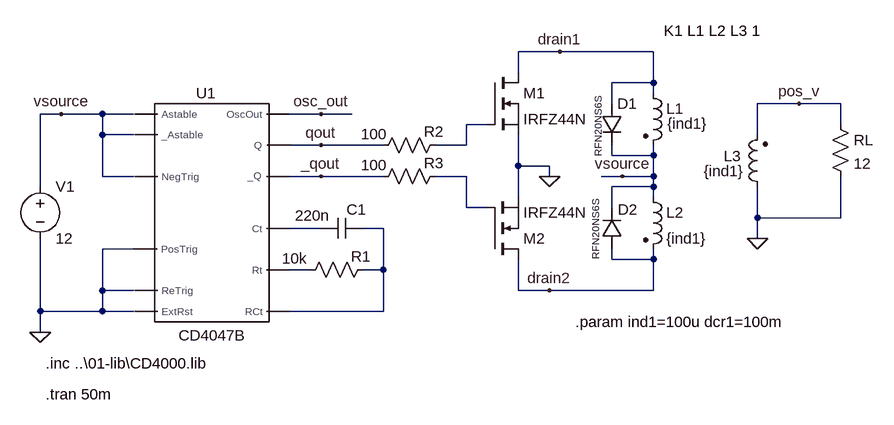
[diagram p0: schematic 02-cd4047b_inverter.asc]
02-cd4047b_inverter.asc, the LTspice schematic file:
Version 4
SHEET 1 1236 680
WIRE 752 -48 688 -48
WIRE 896 -48 752 -48
WIRE 688 -16 688 -48
WIRE 896 0 896 -48
WIRE 896 0 832 0
WIRE 896 16 896 0
WIRE 832 32 832 0
WIRE 1120 32 1056 32
WIRE 1184 32 1120 32
WIRE -16 48 -48 48
WIRE 48 48 -16 48
WIRE 96 48 48 48
WIRE 384 48 336 48
WIRE 432 48 384 48
WIRE 640 64 608 64
WIRE 1184 64 1184 32
WIRE 48 80 48 48
WIRE 96 80 48 80
WIRE 1056 80 1056 32
WIRE 384 96 336 96
WIRE 480 96 384 96
WIRE 608 96 608 64
WIRE 608 96 560 96
WIRE 832 112 832 96
WIRE 896 112 896 96
WIRE 896 112 832 112
WIRE 688 128 688 80
WIRE 736 128 688 128
WIRE 48 144 48 80
WIRE 96 144 48 144
WIRE 384 144 336 144
WIRE 480 144 384 144
WIRE 608 144 560 144
WIRE 736 144 736 128
WIRE 848 144 816 144
WIRE 896 144 896 112
WIRE 896 144 848 144
WIRE -48 160 -48 48
WIRE 896 160 896 144
WIRE 896 160 832 160
WIRE 688 176 688 128
WIRE 896 176 896 160
WIRE 608 192 608 144
WIRE 640 192 608 192
WIRE 832 192 832 160
WIRE 1056 208 1056 160
WIRE 1184 208 1184 144
WIRE 1184 208 1056 208
WIRE 384 224 336 224
WIRE 480 224 448 224
WIRE 1056 240 1056 208
WIRE 96 256 48 256
WIRE 832 272 832 256
WIRE 896 272 896 256
WIRE 896 272 832 272
WIRE 368 288 336 288
WIRE 480 288 480 224
WIRE 480 288 448 288
WIRE 48 320 48 256
WIRE 96 320 48 320
WIRE 688 320 688 272
WIRE 736 320 688 320
WIRE 896 320 896 272
WIRE 896 320 736 320
WIRE -48 352 -48 240
WIRE 48 352 48 320
WIRE 48 352 -48 352
WIRE 96 352 48 352
WIRE 480 352 480 288
WIRE 480 352 336 352
WIRE -48 384 -48 352
FLAG -48 384 0
FLAG 384 48 osc_out
FLAG 384 96 qout
FLAG 384 144 _qout
FLAG 736 144 0
FLAG -16 48 vsource
FLAG 848 144 vsource
FLAG 1056 240 0
FLAG 1120 32 pos_v
FLAG 752 -48 drain1
FLAG 736 320 drain2
SYMBOL CD4047B 208 64 R0
SYMATTR InstName U1
SYMBOL voltage -48 144 R0
WINDOW 123 0 0 Left 0
WINDOW 39 0 0 Left 0
SYMATTR InstName V1
SYMATTR Value 12
SYMBOL cap 448 208 R90
WINDOW 0 3 9 VBottom 2
WINDOW 3 -19 77 VTop 2
SYMATTR InstName C1
SYMATTR Value 220n
SYMBOL res 464 272 R90
WINDOW 0 11 18 VBottom 2
WINDOW 3 -17 120 VTop 2
SYMATTR InstName R1
SYMATTR Value 10k
SYMBOL res 576 80 R90
WINDOW 0 11 18 VBottom 2
WINDOW 3 -17 110 VTop 2
SYMATTR InstName R2
SYMATTR Value 100
SYMBOL res 576 128 R90
WINDOW 0 11 18 VBottom 2
WINDOW 3 -17 110 VTop 2
SYMATTR InstName R3
SYMATTR Value 100
SYMBOL nmos 640 -16 R0
SYMATTR InstName M1
SYMATTR Value IRFZ44N
SYMBOL nmos 640 272 M180
SYMATTR InstName M2
SYMATTR Value IRFZ44N
SYMBOL ind2 880 0 R0
WINDOW 3 37 63 Left 2
SYMATTR Value {ind1}
SYMATTR InstName L1
SYMATTR Type ind
SYMATTR SpiceLine Rser={dcr1}
SYMBOL ind2 880 160 R0
SYMATTR InstName L2
SYMATTR Value {ind1}
SYMATTR Type ind
SYMATTR SpiceLine Rser={dcr1}
SYMBOL ind2 1072 176 R180
WINDOW 0 41 63 Left 2
WINDOW 3 36 40 Left 2
SYMATTR InstName L3
SYMATTR Value {ind1}
SYMATTR Type ind
SYMATTR SpiceLine Rser={dcr1}
SYMBOL diode 816 32 R0
WINDOW 3 -5 -11 VRight 1
SYMATTR Value RFN20NS6S
SYMATTR InstName D1
SYMBOL diode 848 256 R180
WINDOW 0 -24 61 Left 2
WINDOW 3 41 -16 VRight 1
SYMATTR InstName D2
SYMATTR Value RFN20NS6S
SYMBOL res 1168 48 R0
SYMATTR InstName RL
SYMATTR Value 12
TEXT -40 480 Left 2 !.tran 50m
TEXT -40 432 Left 2 !.inc ..\\01-lib\\CD4000.lib
TEXT 912 -80 Left 2 !K1 L1 L2 L3 1
TEXT 776 368 Left 2 !.param ind1=100u dcr1=100m

The netlist it stands for:
* 02-cd4047b_inverter.asc
XU1 N003 N005 N004 vsource vsource vsource 0 0 0 qout _qout osc_out VDD 0 CD4047B VDD=5  SPEED=1.0  TRIPDT=5e-9  ; pins xCt xRt xRct xAstable _xAstable xNegTrig xPosTrig xReTrig xExtRst xQ _xQ xOscOut
V1 vsource 0 12
C1 N004 N003 220n
R1 N004 N005 10k
R2 N001 qout 100
R3 N002 _qout 100
M1 drain1 N001 0 0 IRFZ44N
M2 drain2 N002 0 0 IRFZ44N
L1 drain1 vsource {ind1} Rser={dcr1}
L2 vsource drain2 {ind1} Rser={dcr1}
L3 0 pos_v {ind1} Rser={dcr1}
D1 drain1 vsource RFN20NS6S
D2 drain2 vsource RFN20NS6S
RL pos_v 0 12
.model D D
.lib standard.dio
.model NMOS NMOS
.model PMOS PMOS
.lib standard.mos
.tran 50m
.inc ..\01-lib\CD4000.lib
K1 L1 L2 L3 1
.param ind1=100u dcr1=100m
.lib C:\Users\hop\Documents\GitHub\LTspice\01-lib\CD4047B.sub
.backanno
.end